# Altium schematic sheet Sheet1.SchDoc
size A4; SheetNumber: 1; SheetTotal: 1
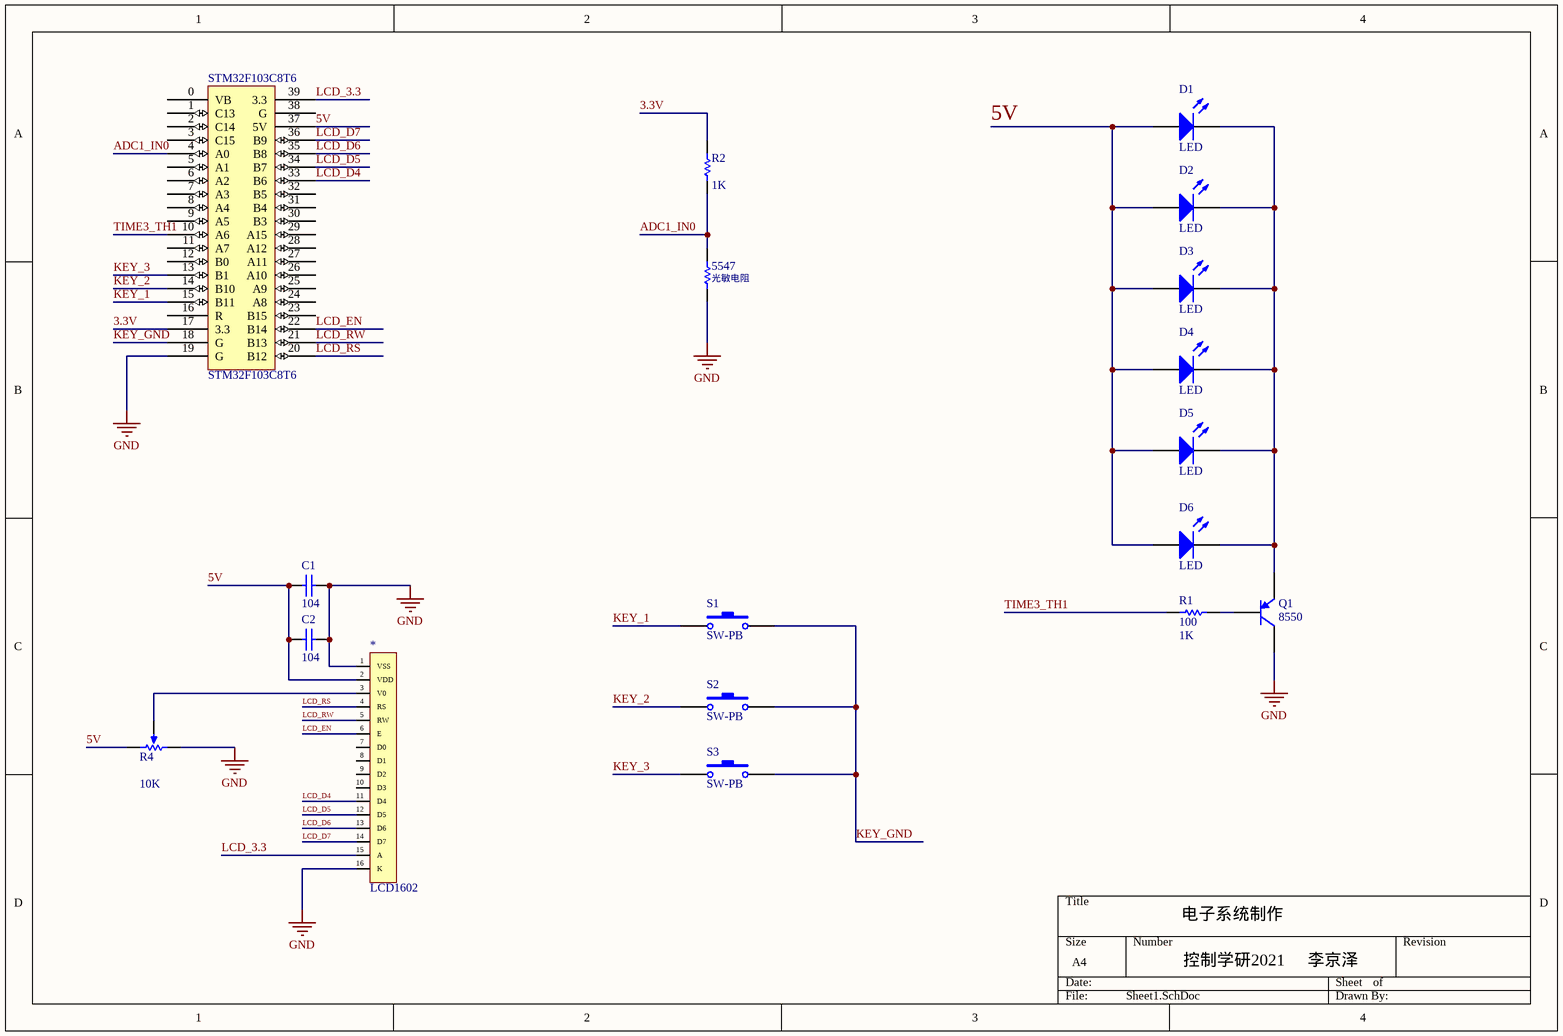
[diagram p0: Sheet1.SchDoc]

## Parts
5547  光敏电阻  [R38]
*  LCD1602  [HDR1X16]
C1  104  [RAD-0.3]
C2  104  [RAD-0.3]
D1  LED  [RB5-10.5]
D2  LED  [RB5-10.5]
D3  LED  [RB5-10.5]
D4  LED  [RB5-10.5]
D5  LED  [RB5-10.5]
D6  LED  [RB5-10.5]
Q1  8550  [TO-92A]
R1  100  value 1K  [AXIAL-0.3]
R2  value 1K  [AXIAL-0.3]  (hidden comment: Res1)
R4  value 10K  [TO-205AF]  (hidden comment: RPot)
S1  SW-PB  [DPST-4]
S2  SW-PB  [DPST-4]
S3  SW-PB  [DPST-4]
STM32F103C8T6  STM32F103C8T6  [HDR1X20]

## Nets
GND: 5547.1 *.1(VSS) *.16(K) C1.2 C2.1 Q1.1(C) R4.1(TOP) STM32F103C8T6.19(G)
3.3V: R2.2 STM32F103C8T6.17(3.3)
5V: *.2(VDD) C1.1 C2.2 D1.1(A) D2.1(A) D3.1(A) D4.1(A) D5.1(A) D6.1(A) R4.2(BOT) STM32F103C8T6.37(5V)
ADC1_IN0: 5547.2 R2.1 STM32F103C8T6.4(A0)
KEY_1: S1.1 STM32F103C8T6.15(B11)
KEY_2: S2.1 STM32F103C8T6.14(B10)
KEY_3: S3.1 STM32F103C8T6.13(B1)
KEY_GND: S1.2 S2.2 S3.2 STM32F103C8T6.18(G)
LCD_3.3: *.15(A) STM32F103C8T6.39(3.3)
LCD_D4: *.11(D4) STM32F103C8T6.33(B6)
LCD_D5: *.12(D5) STM32F103C8T6.34(B7)
LCD_D6: *.13(D6) STM32F103C8T6.35(B8)
LCD_D7: *.14(D7) STM32F103C8T6.36(B9)
LCD_EN: *.6(E) STM32F103C8T6.22(B14)
LCD_RS: *.4(RS) STM32F103C8T6.20(B12)
LCD_RW: *.5(RW) STM32F103C8T6.21(B13)
TIME3_TH1: R1.1 STM32F103C8T6.10(A6)
Net*_3: *.3(V0) R4.3(TAP)
NetD1_2: D1.2(K) D2.2(K) D3.2(K) D4.2(K) D5.2(K) D6.2(K) Q1.3(E)
NetQ1_2: Q1.2(B) R1.2

Not connected (* = marked no-connect by the designer): * 7(D0) 8(D1) 9(D2) 10(D3); STM32F103C8T6 0(VB) 1(C13) 2(C14) 3(C15) 5(A1) 6(A2) 7(A3) 8(A4) 9(A5) 11(A7) 12(B0) 16(R) 23(B15) 24(A8) 25(A9) 26(A10) 27(A11) 28(A12) 29(A15) 30(B3) 31(B4) 32(B5) 38(G)

## Notes on the sheet
- 电子系统制作
- 控制学研2021     李京泽

## Library data of the parts
5547 = Res1: Resistor; Value: 1K; Published: 8-Jun-2000; LatestRevisionDate: 17-Jul-2002; LatestRevisionNote: Re-released for DXP Platform.; PackageReference: AXIAL-0.3; Publisher: Altium Limited; PackageDescription: Axial Device, Thru-Hole; 2 Leads; 0.3 in Pin Spacing
C1 C2 = Cap: Capacitor; Value: 100pF; Published: 8-Jun-2000; LatestRevisionDate: 17-Jul-2002; LatestRevisionNote: Re-released for DXP Platform.; PackageReference: RAD-0.3; Publisher: Altium Limited; PackageDescription: Radial Cap, Thru-Hole; 2 Leads; 0.3 in Pin Spacing
D1-D6 = LED0: Typical INFRARED GaAs LED; Published: 8-Jun-2000; LatestRevisionDate: 08-Jul-2005; LatestRevisionNote: Mech Layer 1 removed.; PackageReference: LED-0; Publisher: Altium Limited; PackageDescription: LED; 2 Leads
Q1 = PNP: PNP Bipolar Transistor; Published: 8-Jun-2000; LatestRevisionDate: 29-May-2009; LatestRevisionNote: IPC-7351 Footprint Added.; PackageVersion: Aug-1999; PackageReference: SOT-23B; Publisher: Altium Limited; PackageDescription: 3-Pin SOT-23 Package 0.95 mm Pitch, 2.4 mm Lead Span
R1 R2 = Res1: Resistor; Published: 8-Jun-2000; LatestRevisionDate: 17-Jul-2002; LatestRevisionNote: Re-released for DXP Platform.; PackageReference: AXIAL-0.3; Publisher: Altium Limited; PackageDescription: Axial Device, Thru-Hole; 2 Leads; 0.3 in Pin Spacing
R4 = RPot: Potentiometer; Sim Note: Enter the Resistance value and the set point into parameter fields.; Set Position: 0.5; Published: 8-Jun-2000; LatestRevisionDate: 17-Jul-2002; LatestRevisionNote: Re-released for DXP Platform.; PackageReference: VR5; Publisher: Altium Limited; PackageDescription: Variable Resistor, Thru-Hole; 3 Leads
S1-S3 = SW-PB: Switch; Published: 24-Mar-1999; LatestRevisionDate: 17-Jul-2002; LatestRevisionNote: Re-released for DXP Platform.; PackageReference: SPST-2; Publisher: Altium Limited; PackageDescription: Switch; 2 Leads